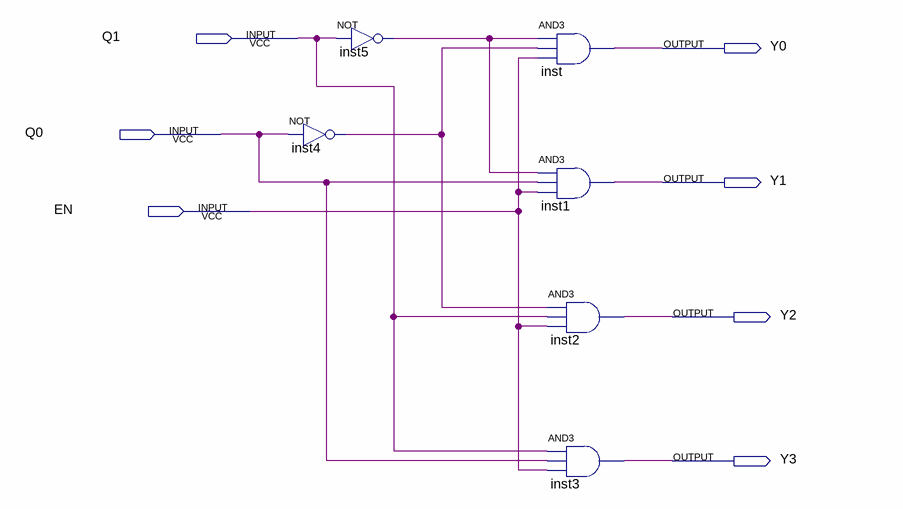
[diagram p0: schematic sheet]
// Quartus schematic DECODER2TO4.bdf as structural Verilog: 6 symbols, 7 pins
module DECODER2TO4 (
  input  Q1,
  input  Q0,
  input  EN,
  output Y0,
  output Y1,
  output Y2,
  output Y3
);

  wire inst4_out, inst5_out;

  not inst5 (inst5_out, Q1);
  not inst4 (inst4_out, Q0);
  and inst (Y0, inst5_out, inst4_out, EN);
  and inst1 (Y1, inst5_out, Q0, EN);
  and inst2 (Y2, inst4_out, Q1, EN);
  and inst3 (Y3, Q1, Q0, EN);
endmodule
